# EAGLE schematic board (EAGLE 6.4)
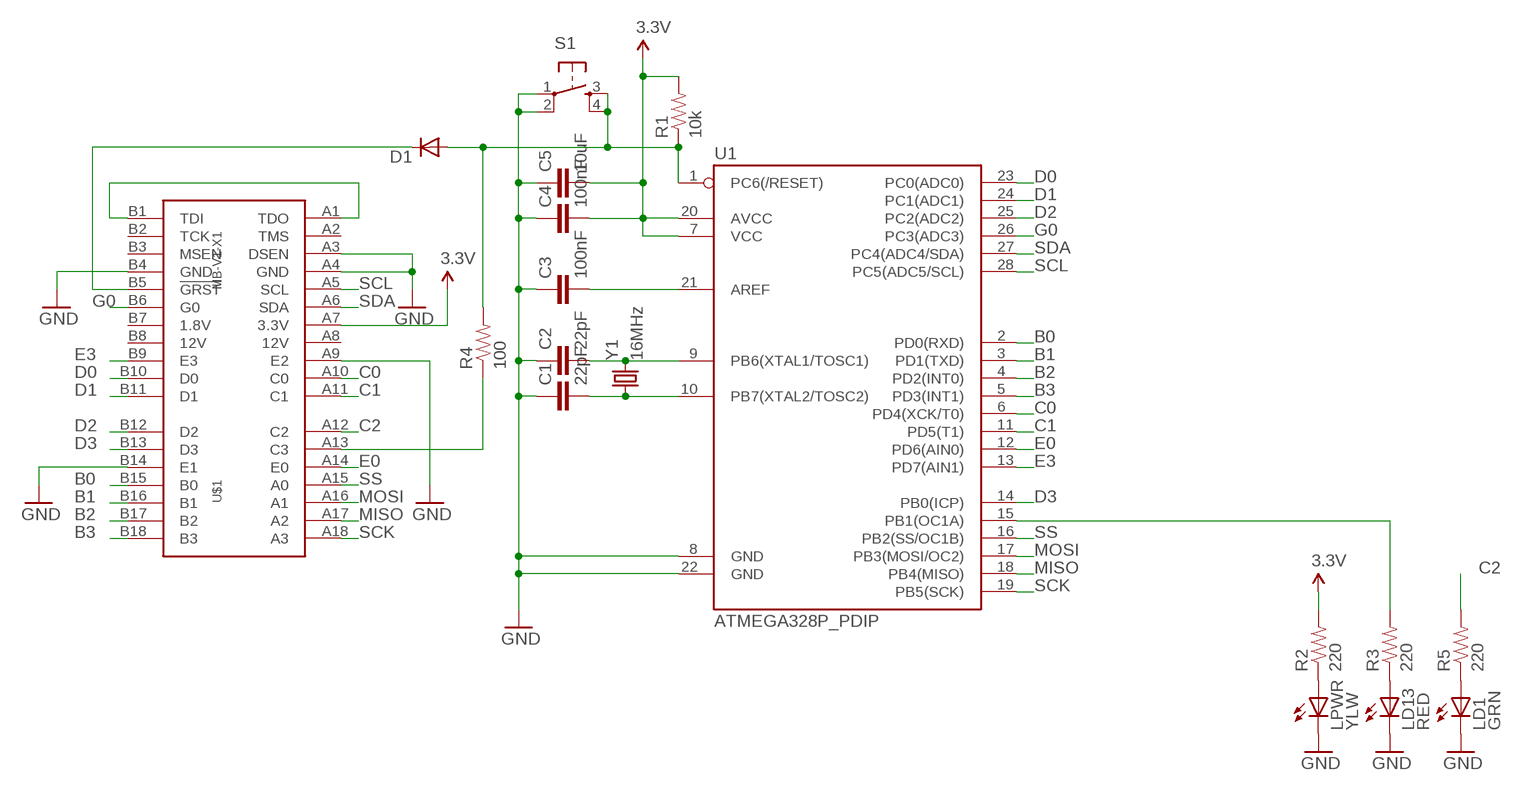
[diagram p0: schematic, sheet 1]

## Parts
C1  22pF  CAP0402-CAP  [0402-CAP]
C2  22pF  CAP0402-CAP  [0402-CAP]
C3  100nF  CAP0402-CAP  [0402-CAP]
C4  100nF  CAP0402-CAP  [0402-CAP]
C5  10uF  CAP0805  [0805]
D1  DIODE1N4148  [DIODE-1N4148]
LD1  GRN  LED-RED0603  [LED-0603]
LD13  RED  LED-RED0603  [LED-0603]
LPWR  YLW  LED-RED0603  [LED-0603]
R1  10k  RESISTOR0603  [0603-RES]
R2  220  RESISTOR0603  [0603-RES]
R3  220  RESISTOR0603  [0603-RES]
R4  100  RESISTOR0603  [0603-RES]
R5  220  RESISTOR0603  [0603-RES]
S1  TAC_SWITCHPTH  [TACTILE-PTH]
U1  ATMEGA328P_PDIP  [DIL28-3]
U$1  MB-V1-X1  [PCIE-X1-EDGE]
Y1  16MHz  CRYSTALHC49US  [HC49US]

## Nets
3.3V: C4.2 C5.2 R1.2 R2.2 U1.7(VCC) U1.20(AVCC) U$1.A7(3.3V)
B0: U1.2(PD0(RXD)) U$1.B15(B0)
B1: U1.3(PD1(TXD)) U$1.B16(B1)
B2: U1.4(PD2(INT0)) U$1.B17(B2)
B3: U1.5(PD3(INT1)) U$1.B18(B3)
C0: U1.6(PD4(XCK/T0)) U$1.A10(C0)
C1: U1.11(PD5(T1)) U$1.A11(C1)
C2: R5.2 U$1.A12(C2)
D0: U1.23(PC0(ADC0)) U$1.B10(D0)
D1: U1.24(PC1(ADC1)) U$1.B11(D1)
D2: U1.25(PC2(ADC2)) U$1.B12(D2)
D3: U1.14(PB0(ICP)) U$1.B13(D3)
E0: U1.12(PD6(AIN0)) U$1.A14(E0)
E3: U1.13(PD7(AIN1)) U$1.B9(E3)
G0: U1.26(PC3(ADC3)) U$1.B6(G0)
GND: C1.1 C2.1 C3.1 C4.1 C5.1 LD1.C LD13.C LPWR.C S1.1 S1.2 U1.8(GND) U1.22(GND) U$1.A3(DSEN) U$1.A4(GND) U$1.A9(E2) U$1.B4(GND) U$1.B14(E1)
MISO: U1.18(PB4(MISO)) U$1.A17(A2)
MOSI: U1.17(PB3(MOSI/OC2)) U$1.A16(A1)
N$1: D1.C U$1.B5(!GRST)
N$2: LD13.A R3.1
N$3: C2.2 U1.9(PB6(XTAL1/TOSC1)) Y1.2
N$4: C1.2 U1.10(PB7(XTAL2/TOSC2)) Y1.1
N$5: C3.2 U1.21(AREF)
N$6: U$1.A1(TDO) U$1.B1(TDI)
N$7: LD1.A R5.1
N$8: R3.2 U1.15(PB1(OC1A))
N$9: R4.1 U$1.A13(C3)
N$25: LPWR.A R2.1
RST: D1.A R1.1 R4.2 S1.3 S1.4 U1.1(PC6(/RESET))
SCK: U1.19(PB5(SCK)) U$1.A18(A3)
SCL: U1.28(PC5(ADC5/SCL)) U$1.A5(SCL)
SDA: U1.27(PC4(ADC4/SDA)) U$1.A6(SDA)
SS: U1.16(PB2(SS/OC1B)) U$1.A15(A0)
Unconnected: U$1.A2(TMS) U$1.A8(12V) U$1.B2(TCK) U$1.B3(MSEN) U$1.B7(1.8V) U$1.B8(12V)

## Library data of the parts
C1-C5 = kmod-passives:CAP: Capacitor Standard 0603 ceramic capacitor, and 0.1" leaded capacitor.
D1 = SparkFun-DiscreteSemi:DIODE: Diode These are standard reverse protection diodes and small signal diodes. SMA package can handle up to about 1A. SOD-323 can handle about 200mA. What the SOD-323 package when ordering, there are some mfgs out there that are 5-pin packages.
LD1 LPWR = SparkFun-LED:LED-RED: Assorted Red LEDs LilyPad 1206- DIO-09912 1206- DIO-00809 0603- DIO-00819; PROD_ID: DIO-00819; VALUE: RED
LD13 = SparkFun-LED:LED-RED: Assorted Red LEDs LilyPad 1206- DIO-09912 1206- DIO-00809 0603- DIO-00819; PROD_ID: DIO-00819
R1 R4 = kmod-passives:RESISTOR: Resistor Basic schematic elements and footprints for 0603, 1206, and PTH resistors.
R2 R3 R5 = SparkFun-Resistors:RESISTOR: Resistor Basic schematic elements and footprints for 0603, 1206, and PTH resistors.
S1 = kmod-mechanical:TAC_SWITCH: Momentary Switch Button commonly used for reset or general input. Spark Fun Electronics SKU : COM-00097 SMT- SWCH-08247
U1 = SparkFun-DigitalIC:ATMEGA328P_PDIP: uC used in the Arduino 32kb flash, 1k EEPROM, 2k SRAM This is the through-hole version of this chip.
U$1 = kmod-connectors:MB-V1-X1
Y1 = SparkFun-FreqCtrl:CRYSTAL: Various standard crystals. Proven footprints. Spark Fun Electronics SKU : COM-00534